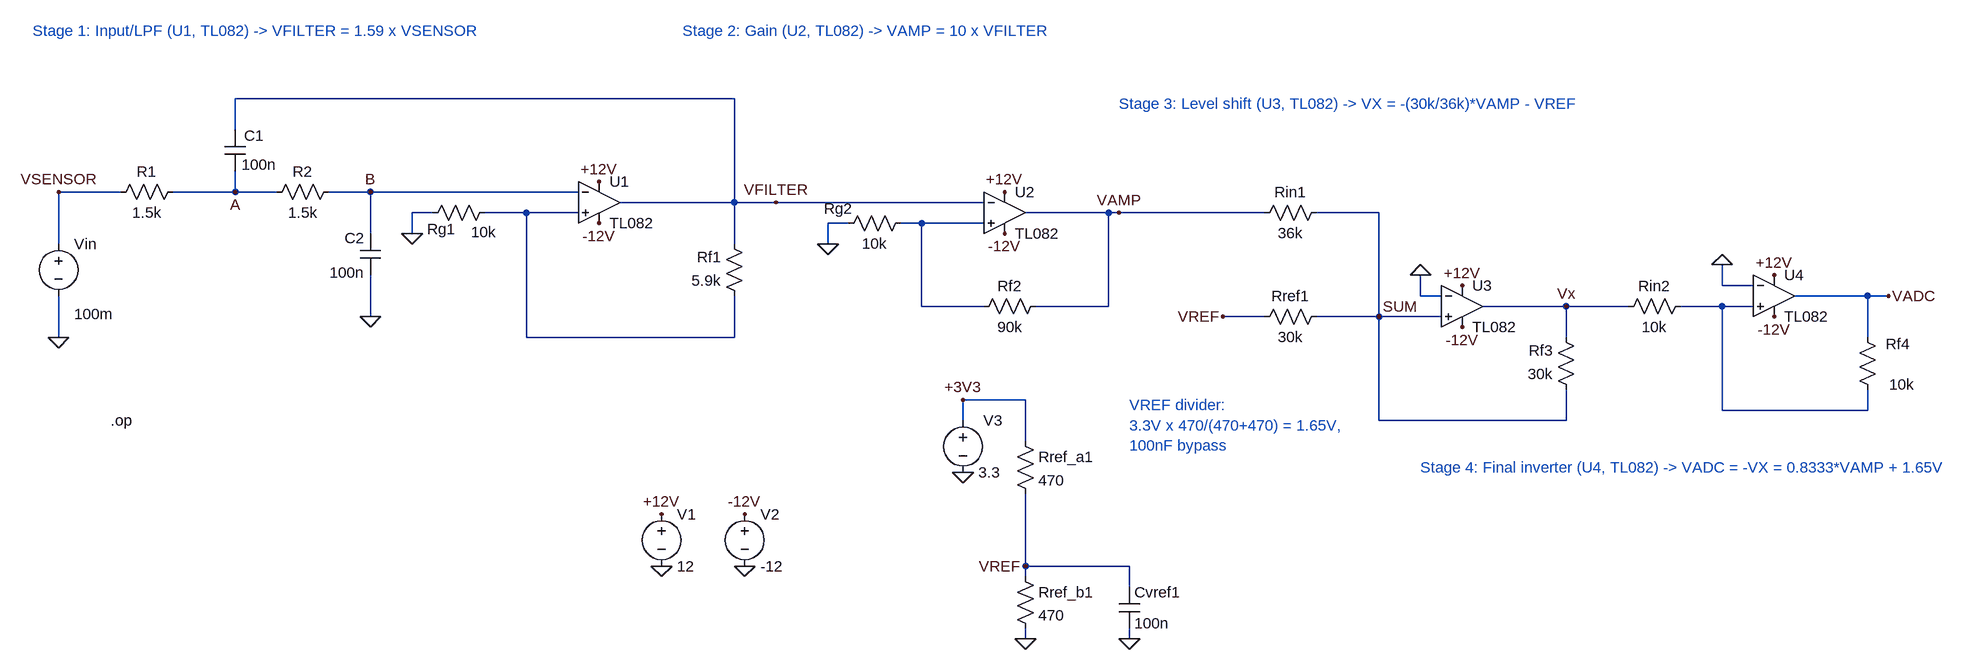
[diagram p0: schematic AFE_IntegrationComplete.asc]
AFE_IntegrationComplete.asc, the LTspice schematic file:
Version 4
SHEET 1 2200 1168
WIRE 176 -112 -592 -112
WIRE -592 -64 -592 -112
WIRE -768 32 -864 32
WIRE -592 32 -592 0
WIRE -592 32 -688 32
WIRE -528 32 -592 32
WIRE -384 32 -448 32
WIRE -64 32 -384 32
WIRE 176 48 176 -112
WIRE 176 48 0 48
WIRE 240 48 176 48
WIRE 560 48 240 48
WIRE -288 64 -320 64
WIRE -144 64 -208 64
WIRE -64 64 -144 64
WIRE 752 64 624 64
WIRE 768 64 752 64
WIRE 992 64 768 64
WIRE 1168 64 1072 64
WIRE 352 80 320 80
WIRE 464 80 432 80
WIRE 560 80 464 80
WIRE -384 96 -384 32
WIRE -320 96 -320 64
WIRE -864 112 -864 32
WIRE 176 112 176 48
WIRE 320 112 320 80
WIRE 1696 176 1696 144
WIRE 1744 176 1696 176
WIRE 1232 192 1232 160
WIRE 1264 192 1232 192
WIRE 1920 192 1808 192
WIRE 1952 192 1920 192
WIRE 464 208 464 80
WIRE 560 208 464 208
WIRE 752 208 752 64
WIRE 752 208 640 208
WIRE 1456 208 1328 208
WIRE 1552 208 1456 208
WIRE 1696 208 1632 208
WIRE 1744 208 1696 208
WIRE -384 224 -384 160
WIRE 992 224 928 224
WIRE 1168 224 1168 64
WIRE 1168 224 1072 224
WIRE 1264 224 1168 224
WIRE -864 256 -864 192
WIRE -144 256 -144 64
WIRE 176 256 176 192
WIRE 176 256 -144 256
WIRE 1456 256 1456 208
WIRE 1920 256 1920 192
WIRE 624 352 528 352
WIRE 1696 368 1696 208
WIRE 1920 368 1920 336
WIRE 1920 368 1696 368
WIRE 528 384 528 352
WIRE 1168 384 1168 224
WIRE 1456 384 1456 336
WIRE 1456 384 1168 384
WIRE 624 416 624 352
WIRE 624 608 624 496
WIRE 784 608 624 608
WIRE 624 624 624 608
WIRE 784 640 784 608
WIRE 624 720 624 704
WIRE 784 720 784 704
FLAG -592 32 A
FLAG -384 32 B
FLAG -864 256 0
FLAG -384 224 0
FLAG 240 48 VFILTER
FLAG -320 96 0
FLAG 768 64 VAMP
FLAG 320 112 0
FLAG -864 32 VSENSOR
FLAG 1168 224 SUM
FLAG 1232 160 0
FLAG 1696 144 0
FLAG 1456 208 Vx
FLAG 1952 192 VADC
FLAG 64 528 +12V
FLAG 64 608 0
FLAG 192 528 -12V
FLAG 192 608 0
FLAG -32 16 +12V
FLAG 592 32 +12V
FLAG 1776 160 +12V
FLAG 1296 176 +12V
FLAG -32 80 -12V
FLAG 592 96 -12V
FLAG 1296 240 -12V
FLAG 1776 224 -12V
FLAG 528 352 +3V3
FLAG 624 608 VREF
FLAG 528 464 0
FLAG 624 720 0
FLAG 784 720 0
FLAG 928 224 VREF
SYMBOL voltage -864 96 R0
WINDOW 123 24 124 Left 2
WINDOW 39 0 0 Left 0
SYMATTR Value2 100m
SYMATTR InstName Vin
SYMATTR Value ""
SYMBOL res -672 16 R90
WINDOW 0 0 56 VBottom 2
WINDOW 3 32 56 VTop 2
SYMATTR InstName R1
SYMATTR Value 1.5k
SYMBOL res -432 16 R90
WINDOW 0 0 56 VBottom 2
WINDOW 3 32 56 VTop 2
SYMATTR InstName R2
SYMATTR Value 1.5k
SYMBOL cap -608 -64 R0
WINDOW 0 30 9 Left 2
WINDOW 3 26 54 Left 2
SYMATTR InstName C1
SYMATTR Value 100n
SYMBOL cap -400 96 R0
WINDOW 0 -24 7 Left 2
WINDOW 3 -47 60 Left 2
SYMATTR InstName C2
SYMATTR Value 100n
SYMBOL res 192 208 R180
WINDOW 0 36 76 Left 2
WINDOW 3 36 40 Left 2
SYMATTR InstName Rf1
SYMATTR Value 5.9k
SYMBOL res -192 48 R90
WINDOW 0 57 83 VBottom 2
WINDOW 3 30 18 VTop 2
SYMATTR InstName Rg1
SYMATTR Value 10k
SYMBOL res 656 192 R90
WINDOW 0 0 56 VBottom 2
WINDOW 3 32 56 VTop 2
SYMATTR InstName Rf2
SYMATTR Value 90k
SYMBOL res 448 64 R90
WINDOW 0 9 112 VBottom 2
WINDOW 3 32 56 VTop 2
SYMATTR InstName Rg2
SYMATTR Value 10k
SYMBOL res 1088 48 R90
WINDOW 0 0 56 VBottom 2
WINDOW 3 32 56 VTop 2
SYMATTR InstName Rin1
SYMATTR Value 36k
SYMBOL res 1088 208 R90
WINDOW 0 0 56 VBottom 2
WINDOW 3 32 56 VTop 2
SYMATTR InstName Rref1
SYMATTR Value 30k
SYMBOL res 1472 352 R180
WINDOW 0 36 76 Left 2
WINDOW 3 36 40 Left 2
SYMATTR InstName Rf3
SYMATTR Value 30k
SYMBOL res 1648 192 R90
WINDOW 0 0 56 VBottom 2
WINDOW 3 32 56 VTop 2
SYMATTR InstName Rin2
SYMATTR Value 10k
SYMBOL res 1936 352 R180
WINDOW 0 -49 86 Left 2
WINDOW 3 -56 24 Left 2
SYMATTR InstName Rf4
SYMATTR Value 10k
SYMBOL opamp2 -32 -16 R0
SYMATTR InstName U1
SYMATTR Value TL082
SYMBOL opamp2 592 0 R0
SYMATTR InstName U2
SYMATTR Value TL082
SYMBOL opamp2 1296 144 R0
SYMATTR InstName U3
SYMATTR Value TL082
SYMBOL opamp2 1776 128 R0
SYMATTR InstName U4
SYMATTR Value TL082
SYMBOL voltage 64 512 R0
SYMATTR InstName V1
SYMATTR Value 12
SYMBOL voltage 192 512 R0
SYMATTR InstName V2
SYMATTR Value -12
SYMBOL voltage 528 368 R0
WINDOW 0 31 16 Left 2
SYMATTR InstName V3
SYMATTR Value 3.3
SYMBOL res 608 400 R0
SYMATTR InstName Rref_a1
SYMATTR Value 470
SYMBOL res 608 608 R0
SYMATTR InstName Rref_b1
SYMATTR Value 470
SYMBOL cap 768 640 R0
SYMATTR InstName Cvref1
SYMATTR Value 100n
TEXT 784 360 Left 2 ;VREF divider: \n3.3V x 470/(470+470) = 1.65V, \n100nF bypass
TEXT -904 -216 Left 2 ;Stage 1: Input/LPF (U1, TL082) -> VFILTER = 1.59 x VSENSOR
TEXT 96 -216 Left 2 ;Stage 2: Gain (U2, TL082) -> VAMP = 10 x VFILTER
TEXT 768 -104 Left 2 ;Stage 3: Level shift (U3, TL082) -> VX = -(30k/36k)*VAMP - VREF
TEXT 1232 456 Left 2 ;Stage 4: Final inverter (U4, TL082) -> VADC = -VX = 0.8333*VAMP + 1.65V
TEXT -784 384 Left 2 !.op

The netlist it stands for:
* AFE_IntegrationComplete.asc
Vin VSENSOR 0 100m
R1 A VSENSOR 1.5k
R2 B A 1.5k
C1 VFILTER A 100n
C2 B 0 100n
Rf1 N001 VFILTER 5.9k
Rg1 N001 0 10k
Rf2 VAMP N002 90k
Rg2 N002 0 10k
Rin1 SUM VAMP 36k
Rref1 SUM VREF 30k
Rf3 SUM Vx 30k
Rin2 N003 Vx 10k
Rf4 N003 VADC 10k
XU1 N001 B +12V -12V VFILTER TL082  ; pins In+ In- V+ V- OUT
XU2 N002 VFILTER +12V -12V VAMP TL082  ; pins In+ In- V+ V- OUT
XU3 SUM 0 +12V -12V Vx TL082  ; pins In+ In- V+ V- OUT
XU4 N003 0 +12V -12V VADC TL082  ; pins In+ In- V+ V- OUT
V1 +12V 0 12
V2 -12V 0 -12
V3 +3V3 0 3.3
Rref_a1 +3V3 VREF 470
Rref_b1 VREF 0 470
Cvref1 VREF 0 100n
* VREF divider:
* 3.3V x 470/(470+470) = 1.65V,
* 100nF bypass
* Stage 1: Input/LPF (U1, TL082) -> VFILTER = 1.59 x VSENSOR
* Stage 2: Gain (U2, TL082) -> VAMP = 10 x VFILTER
* Stage 3: Level shift (U3, TL082) -> VX = -(30k/36k)*VAMP - VREF
* Stage 4: Final inverter (U4, TL082) -> VADC = -VX = 0.8333*VAMP + 1.65V
.op
.backanno
.end